# EAGLE design LED (EAGLE 4.16)
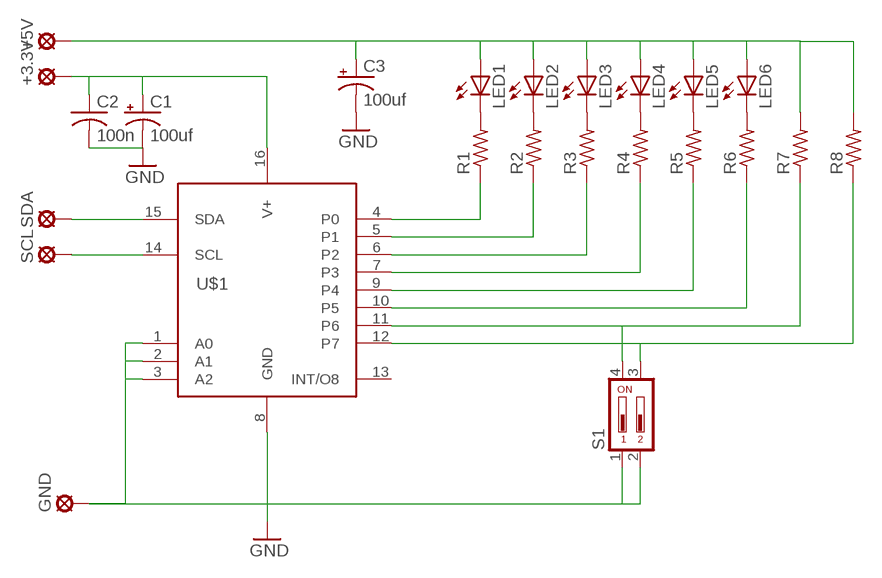
[diagram p0: schematic, sheet 1]

## Parts
+3.3V  LSP10  [LSP10]
+5V  LSP10  [LSP10]
C1  100uf  CPOL-USE3.5-8  [E3,5-8]
C2  100n  C-USC1206K  [C1206K]
C3  100uf  CPOL-USE3.5-8  [E3,5-8]
GND  LSP10  [LSP10]
LED1  LED5MM  [LED5MM]
LED2  LED5MM  [LED5MM]
LED3  LED5MM  [LED5MM]
LED4  LED5MM  [LED5MM]
LED5  LED5MM  [LED5MM]
LED6  LED5MM  [LED5MM]
R1  R-US_0204/7  [0204/7]
R2  R-US_0204/7  [0204/7]
R3  R-US_0204/7  [0204/7]
R4  R-US_0204/7  [0204/7]
R5  R-US_0204/7  [0204/7]
R6  R-US_0204/7  [0204/7]
R7  R-US_0204/7  [0204/7]
R8  R-US_0204/7  [0204/7]
S1  DA02  [DA-02]
SCL  LSP10  [LSP10]
SDA  LSP10  [LSP10]
U$1  MAX7315  [TSSOP16]

## Nets
GND: C1.- C2.2 C3.- GND.MP S1.1 S1.2 U$1.1(A0) U$1.2(A1) U$1.3(A2) U$1.8(GND)
N$1: LED1.K(C) R1.2
N$2: LED2.K(C) R2.2
N$3: LED3.K(C) R3.2
N$4: LED4.K(C) R4.2
N$5: LED5.K(C) R5.2
N$6: LED6.K(C) R6.2
N$7: R1.1 U$1.4(P0)
N$8: R2.1 U$1.5(P1)
N$9: R3.1 U$1.6(P2)
N$10: R4.1 U$1.7(P3)
N$11: R5.1 U$1.9(P4)
N$12: R6.1 U$1.10(P5)
N$13: R7.1 S1.4 U$1.11(P6)
N$14: R8.1 S1.3 U$1.12(P7)
N$15: +5V.MP C3.+ LED1.A LED2.A LED3.A LED4.A LED5.A LED6.A R7.2 R8.2
N$16: SCL.MP U$1.14(SCL)
N$17: SDA.MP U$1.15(SDA)
N$18: +3.3V.MP C1.+ C2.1 U$1.16(V+)
Unconnected: U$1.13(INT/O8)

## Library data of the parts
+3.3V +5V GND SCL SDA = solpad:LSP10: SOLDER PAD drill 1.0 mm, distributor Buerklin, 12H555
C1 C3 = rcl:CPOL-US: POLARIZED CAPACITOR, American symbol
C2 = rcl:C-US: CAPACITOR, American symbol
LED1-LED6 = led:LED: LED OSRAM: - CHIPLED LG R971, LG N971, LY N971, LG Q971, LY Q971, LO R971, LY R971 LH N974, LH R974 LS Q976, LO Q976, LY Q976 LO Q996 - Hyper CHIPLED LW Q18S LB Q993, LB Q99A, LB R99A - SideLED LS A670, LO A670, LY A670, LG A670, LP A670 LB A673, LV A673, LT A673, LW A673 LH A674 LY A675 LS A676, LA A676, LO A676, LY A676, LW A676 LS A679, LY A679, LG A679 - Hyper Micro SIDELED® LS Y876, LA Y876, LO Y876, LY Y876 LT Y87S - SmartLED LW L88C, LW L88S LB L89C, LB L89S, LG L890 LS L89K, LO L89K, LY L89K LS L896, LA L896, LO L896, LY L896 - TOPLED LS T670, LO T670, LY T670, LG T670, LP T670 LSG T670, LSP T670, LSY T670, LOP T670, LYG T670 LG T671, LOG T671, LSG T671 LB T673, LV T673, LT T673, LW T673 LH T674 LS T676, LA T676, LO T676, LY T676, LB T676, LH T676, LSB T676, LW T676 LB T67C, LV T67C, LT T67C, LS T67K, LO T67K, LY T67K, LW E67C LS E67B, LA E67B, LO E67B, LY E67B, LB E67C, LV E67C, LT E67C LW T67C LS T679, LY T679, LG T679 LS T770, LO T770, LY T770, LG T770, LP T770 LB T773, LV T773, LT T773, LW T773 LH T774 LS E675, LA E675, LY E675, LS T675 LS T776, LA T776, LO T776, LY T776, LB T776 LHGB T686 LT T68C, LB T68C - Hyper Mini TOPLED® LB M676 - Mini TOPLED Santana® LG M470 LS M47K, LO M47K, LY M47K Source: http://www.osram.convergy.de - LUMILED® LXK2-PW12-R00, LXK2-PW12-S00, LXK2-PW14-U00, LXK2-PW14-V00 LXK2-PM12-R00, LXK2-PM12-S00, LXK2-PM14-U00 LXK2-PE12-Q00, LXK2-PE12-R00, LXK2-PE12-S00, LXK2-PE14-T00, LXK2-PE14-U00 LXK2-PB12-K00, LXK2-PB12-L00, LXK2-PB12-M00, LXK2-PB14-N00, LXK2-PB14-P00, LXK2-PB14-Q00 LXK2-PR12-L00, LXK2-PR12-M00, LXK2-PR14-Q00, LXK2-PR14-R00 LXK2-PD12-Q00, LXK2-PD12-R00, LXK2-PD12-S00 LXK2-PH12-R00, LXK2-PH12-S00 LXK2-PL12-P00, LXK2-PL12-Q00, LXK2-PL12-R00 Source: www.luxeon.com
R1-R8 = rcl:R-US_: RESISTOR, American symbol
S1 = switch-dil:DA02: DIL/CODE SWITCH
U$1 = ZStofer:MAX7315: 8 Port I2C expander with LED intensity control

## Board
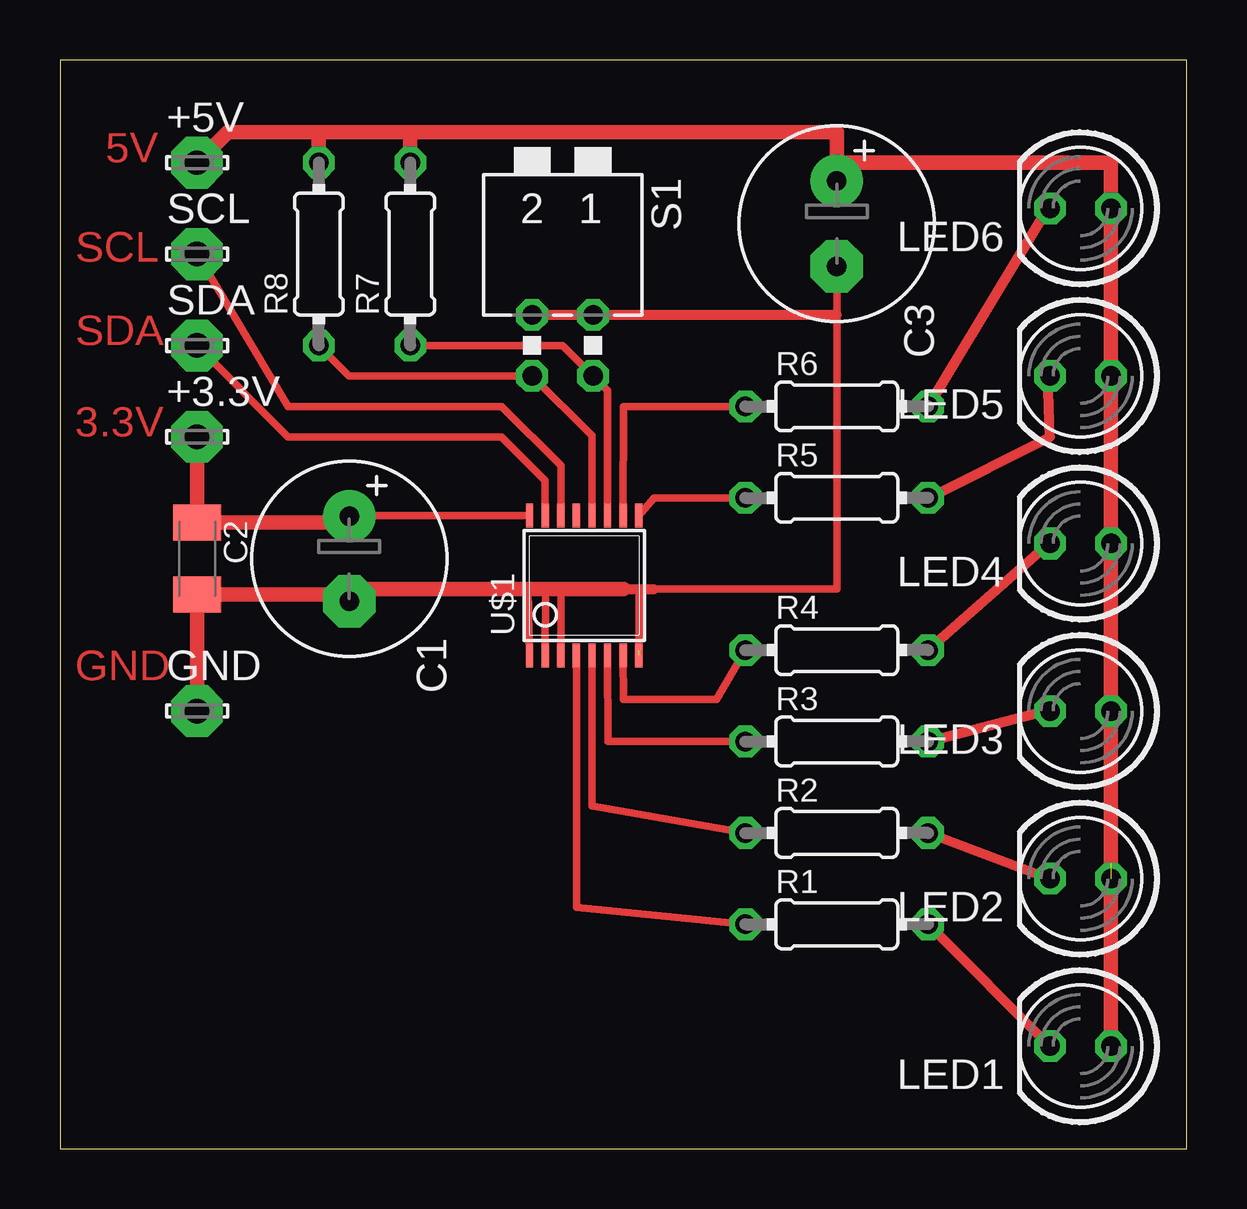
[diagram p1: board, top side]

Size 46.97 x 45.39 mm. Coordinates in mm from the lower left corner, seen from the top.
Outline: 0,0 46.97,0 46.97,45.39 0,45.39 0,0
Copper layers (1*2+15*16): Top 0.035mm / dielectric 0.2mm / Route2 0.035mm / dielectric 0.15mm / Route15 0.035mm / dielectric 0.2mm / Bottom 0.035mm
Design rules "default": minimum track width 10mil, minimum drill 24mil, track to track 8mil, track to pad 8mil, pad to pad 8mil, via to via 8mil, smd to smd 8mil, copper to edge 40mil, drill to drill 8mil, minimum pad ring 10mil, minimum via ring 8mil, stop-mask expansion 4mil, vias tented up to drill 0mil, thermal gap 10mil

### Footprints (pad centres in the part's own frame; a part is rotated, then mirrored left to right if it is on the bottom)
LSP10 = drill 1.016 pad 2.159 octagon: MP 0,0
E3,5-8 = drill 0.813 pad 2.184 round: + -1.778,0 | drill 0.813 pad 2.184 octagon: - 1.778,0
C1206K = smd 1.5 x 2: 1 -1.5,0; 2 1.5,0
LED5MM = drill 0.813 octagon: A -1.27,0; K 1.27,0
0204/7 = drill 0.813 octagon: 1 -3.81,0; 2 3.81,0
DA-02 = drill 0.813 octagon: 1 -1.27,-1.27; 2 1.27,-1.27; 3 1.27,1.27; 4 -1.27,1.27
TSSOP16 = smd 0.305 x 0.991: 1 -2.275,-2.918; 2 -1.625,-2.918; 3 -0.975,-2.918; 4 -0.325,-2.918; 5 0.325,-2.918; 6 0.975,-2.918; 7 1.625,-2.918; 8 2.275,-2.918; 9 2.275,2.918; 10 1.625,2.918; 11 0.975,2.918; 12 0.325,2.918; 13 -0.325,2.918; 14 -0.975,2.918; 15 -1.625,2.918; 16 -2.275,2.918

### Placement (x,y rotation side)
+3.3V  5.71,29.68 0 top
+5V  5.71,41.11 0 top
C1  12.06,24.6 270 top
C2  5.71,24.6 270 top
C3  32.38,38.57 270 top
GND  5.71,18.25 0 top
LED1  42.54,4.28 180 top
LED2  42.54,11.27 180 top
LED3  42.54,18.25 180 top
LED4  42.54,25.23 180 top
LED5  42.54,32.22 180 top
LED6  42.54,39.2 180 top
R1  32.38,9.36 0 top
R2  32.38,13.17 0 top
R3  32.38,16.98 0 top
R4  32.38,20.79 0 top
R5  32.38,27.14 0 top
R6  32.38,30.95 0 top
R7  14.6,37.3 90 top
R8  10.79,37.3 90 top
S1  20.95,33.49 180 top
SCL  5.71,37.3 0 top
SDA  5.71,33.49 0 top
U$1  21.85,23.48 0 top

### Tracks (layer width: path | path; a pad name or v marks a point on that pad's centre or on a via)
GND  (2 unrouted)
  Top 0.305: C3.- 32.38,34.76 32.38,23.33 24.76,23.33 24.12,23.33 24.12,20.79 | 20.88,23.33 20.88,23.4 U$1.3 | 19.52,23.33 19.52,23.31 U$1.1 | 20.22,23.33 20.24,23.21 U$1.2
  Top 0.406: 32.38,34.76 S1.2 | 23.49,23.33 24.76,23.33
  Top 0.61: C2.2 5.71,23.33 | GND.MP C2.2 | C2.2 11.53,23.11 12.06,22.06 C1.- 12.06,23.33 19.52,23.33 20.22,23.33 20.88,23.33 23.49,23.33
N$1
  Top 0.406: R1.2 LED1.K
N$2
  Top 0.406: LED2.K 41.22,11.28 R2.2
N$3
  Top 0.406: LED3.K 41.22,18.3 R3.2
N$4
  Top 0.406: LED4.K 41.31,25.32 R4.2
N$5
  Top 0.406: R5.2 41.27,29.68 41.17,32.21 LED5.K
N$6
  Top 0.406: LED6.K 41.17,39.18 R6.2
N$7
  Top 0.305: U$1.4 21.53,10.07 R1.1
N$8
  Top 0.305: U$1.5 22.18,14.3 R2.1
N$9
  Top 0.305: U$1.6 22.84,16.98 R3.1
N$10
  Top 0.305: U$1.7 23.5,18.73 27.36,18.73 R4.1
N$11
  Top 0.305: U$1.9 24.76,27.14 R5.1
N$12
  Top 0.305: U$1.10 23.49,30.95 R6.1
N$13
  Top 0.305: U$1.11 22.83,31.61 S1.4 20.95,33.49 R7.1
N$14
  Top 0.305: U$1.12 22.18,29.72 S1.3 12.06,32.22 R8.1
N$15  (1 unrouted)
  Top 0.61: 32.38,41.11 43.81,41.11 LED6.A LED5.A LED4.A LED3.A 43.81,11.9 | LED1.A LED2.A | 32.38,39.84 C3.+ 32.38,41.11 | +5V.MP 6.98,42.38 10.79,42.38 | 10.79,42.38 14.6,42.38 | 14.6,42.38 32.38,42.38 32.38,41.11 | 10.79,42.38 R8.2 | 14.6,42.38 R7.2
N$16
  Top 0.305: U$1.14 20.88,28.48 18.41,30.95 9.52,30.95 SCL.MP
N$17
  Top 0.305: U$1.15 20.23,27.86 18.41,29.68 9.52,29.68 SDA.MP
N$18
  Top 0.305: C1.+ 12.04,26.4 U$1.16
  Top 0.61: C2.1 5.71,25.87 | C2.1 +3.3V.MP | C1.+ 12.06,25.87 11.83,26.1 C2.1

### Text on the board
Top: 5V | SCL | SDA | 3.3V | GND